# EAGLE design desticka (EAGLE 7.2.0)
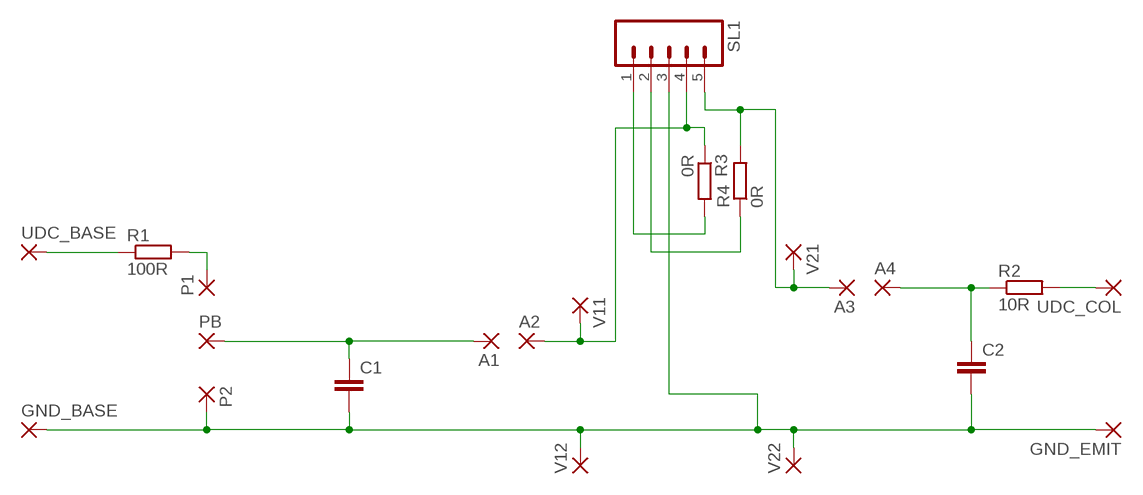
[diagram p0: schematic, sheet 1]

## Parts
A1  3,17/1,3  [3,17/1,3]
A2  3,17/1,3  [3,17/1,3]
A3  3,17/1,3  [3,17/1,3]
A4  3,17/1,3  [3,17/1,3]
C1  C-EU050-055X075  [C050-055X075]
C2  C-EU050-055X075  [C050-055X075]
GND_BASE  3,17/1,3  [3,17/1,3]
GND_EMIT  3,17/1,3  [3,17/1,3]
P1  2,54/1,0  [2,54/1,0]
P2  2,54/1,0  [2,54/1,0]
PB  2,54/1,0  [2,54/1,0]
R1  100R  R-EU_0613/15  [P0613/15]
R2  10R  R-EU_0613/15  [P0613/15]
R3  0R  R-EU_0207/7  [0207/7]
R4  0R  R-EU_0207/7  [0207/7]
SL1  M05  [05P]
UDC_BASE  3,17/1,3  [3,17/1,3]
UDC_COL  3,17/1,3  [3,17/1,3]
V11  3,17/1,3  [3,17/1,3]
V12  3,17/1,3  [3,17/1,3]
V21  3,17/1,3  [3,17/1,3]
V22  3,17/1,3  [3,17/1,3]

## Nets
N$1: A1.1(P) C1.1 PB.1(P)
N$2: R3.2 SL1.1
N$3: R2.2 UDC_COL.1(P)
N$4: R1.1 UDC_BASE.1(P)
N$5: P1.1(P) R1.2
N$6: R4.1 SL1.2
N$7: A4.1(P) C2.1 R2.1
N$8: C1.2 C2.2 GND_BASE.1(P) GND_EMIT.1(P) P2.1(P) SL1.3 V12.1(P) V22.1(P)
N$9: A3.1(P) R4.2 SL1.5 V21.1(P)
N$10: A2.1(P) R3.1 SL1.4 V11.1(P)

## Library data of the parts
A1-A4 GND_BASE GND_EMIT UDC_BASE UDC_COL V11 V12 V21 V22 = wirepad:3,17/1,3: THROUGH-HOLE PAD
C1 C2 = rcl:C-EU: CAPACITOR, European symbol
P1 P2 PB = wirepad:2,54/1,0: THROUGH-HOLE PAD
R1-R4 = rcl:R-EU_: RESISTOR, European symbol
SL1 = con-amp-quick:M05: AMP QUICK CONNECTOR; OC_FARNELL: unknown; OC_NEWARK: unknown

## Board
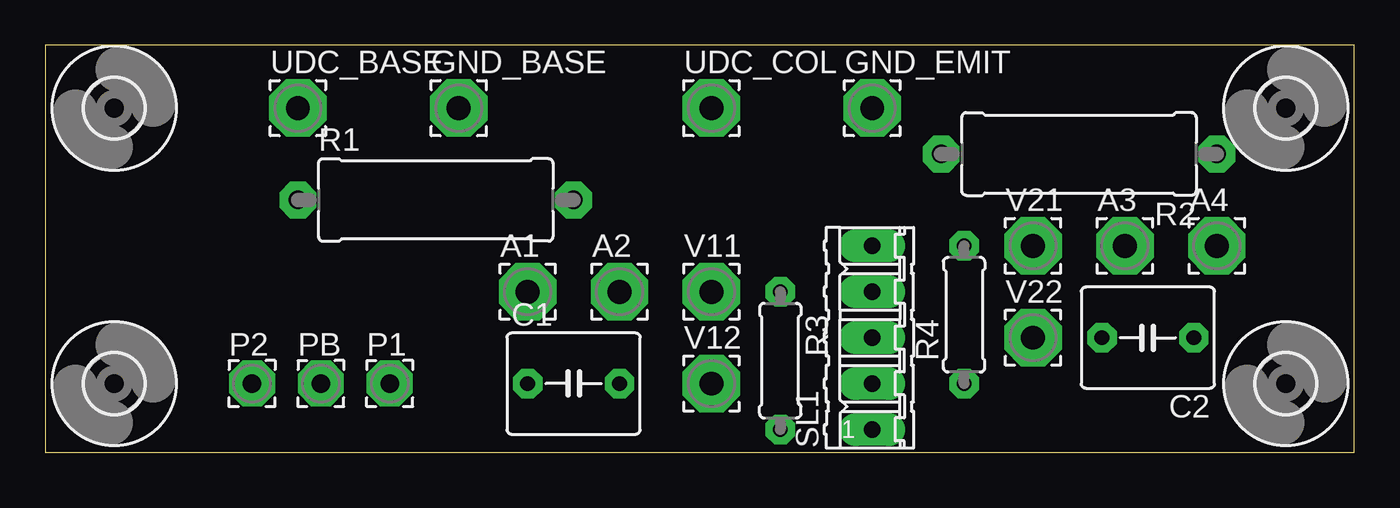
[diagram p1: board, top side]
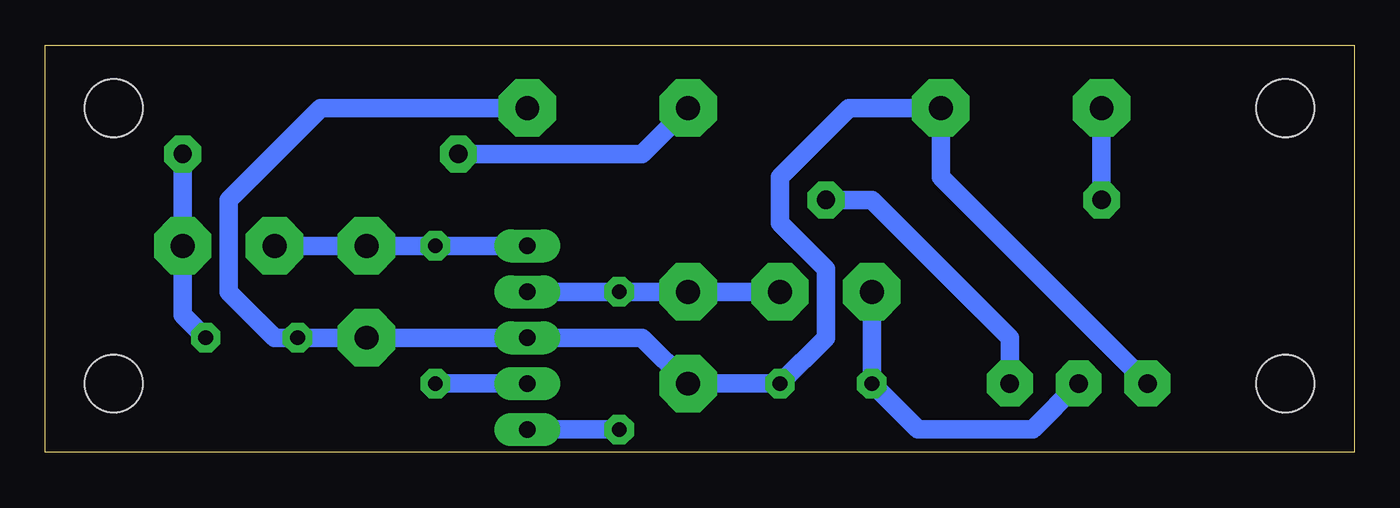
[diagram p2: board, bottom side, seen from below]

Size 72.37 x 22.53 mm. Coordinates in mm from the lower left corner, seen from the top.
Outline: 0,0 72.37,0 72.37,22.53 0,22.53 0,0
Copper layers (1*16): Top 0.035mm / dielectric 1.5mm / Bottom 0.035mm
Design rules "default *": minimum track width 10mil, minimum drill 24mil, track to track 8mil, track to pad 8mil, pad to pad 8mil, via to via 8mil, smd to smd 8mil, copper to edge 40mil, drill to drill 8mil, minimum pad ring 10mil, minimum via ring 8mil, stop-mask expansion 4mil, vias tented up to drill 0mil, thermal gap 10mil

### Footprints (pad centres in the part's own frame; a part is rotated, then mirrored left to right if it is on the bottom)
3,17/1,3 = drill 1.321 pad 3.175 octagon: 1 0,0
C050-055X075 = drill 0.813 octagon: 1 -2.54,0; 2 2.54,0
2,54/1,0 = drill 1.016 pad 2.54 octagon: 1 0,0
P0613/15 = drill 1.016 octagon: 1 -7.62,0; 2 7.62,0
0207/7 = drill 0.813 octagon: 1 -3.81,0; 2 3.81,0
05P = drill 0.914 long: 1 -5.08,0; 2 -2.54,0; 3 0,0; 4 2.54,0; 5 5.08,0
3,2 = hole 3.2: 0,0

### Placement (x,y rotation side)
A1  26.67,8.89 0 top
A2  31.75,8.89 0 top
A3  59.69,11.43 0 top
A4  64.77,11.43 0 top
C1  29.21,3.81 0 top
C2  60.96,6.35 180 top
GND_BASE  22.86,19.05 0 top
GND_EMIT  45.72,19.05 0 top
P1  19.05,3.81 0 top
P2  11.43,3.81 0 top
PB  15.24,3.81 0 top
R1  21.59,13.97 0 top
R2  57.15,16.51 180 top
R3  40.64,5.08 270 top
R4  50.8,7.62 90 top
SL1  45.72,6.35 90 top
U$1  [3,2]  68.58,19.05 0 top
U$2  [3,2]  68.58,3.81 0 top
U$3  [3,2]  3.81,19.05 0 top
U$4  [3,2]  3.81,3.81 0 top
UDC_BASE  13.97,19.05 0 top
UDC_COL  36.83,19.05 0 top
V11  36.83,8.89 0 top
V12  36.83,3.81 0 top
V21  54.61,11.43 0 top
V22  54.61,6.35 0 top

### Tracks (layer width: path | path; a pad name or v marks a point on that pad's centre or on a via)
N$1
  Bottom 1.016: A1.1 C1.1 24.13,1.27 17.78,1.27 PB.1
N$2
  Bottom 1.016: R3.2 SL1.1
N$3
  Bottom 1.016: R2.2 39.37,16.51 UDC_COL.1
N$4
  Bottom 1.016: R1.1 UDC_BASE.1
N$5
  Bottom 1.016: P1.1 19.05,6.35 26.67,13.97 R1.2
N$6
  Bottom 1.016: SL1.2 R4.1
N$7
  Bottom 1.016: C2.1 64.77,7.62 A4.1 R2.1
N$8
  Bottom 1.016: GND_EMIT.1 57.15,19.05 62.23,13.97 62.23,8.89 59.69,6.35 C2.2 V22.1 SL1.3 39.37,6.35 V12.1 C1.2 29.21,6.35 29.21,10.16 31.75,12.7 31.75,15.24 27.94,19.05 GND_BASE.1 22.86,15.24 P2.1
N$9
  Bottom 1.016: SL1.5 R4.2 V21.1 A3.1
N$10
  Bottom 1.016: A2.1 V11.1 R3.1 SL1.4